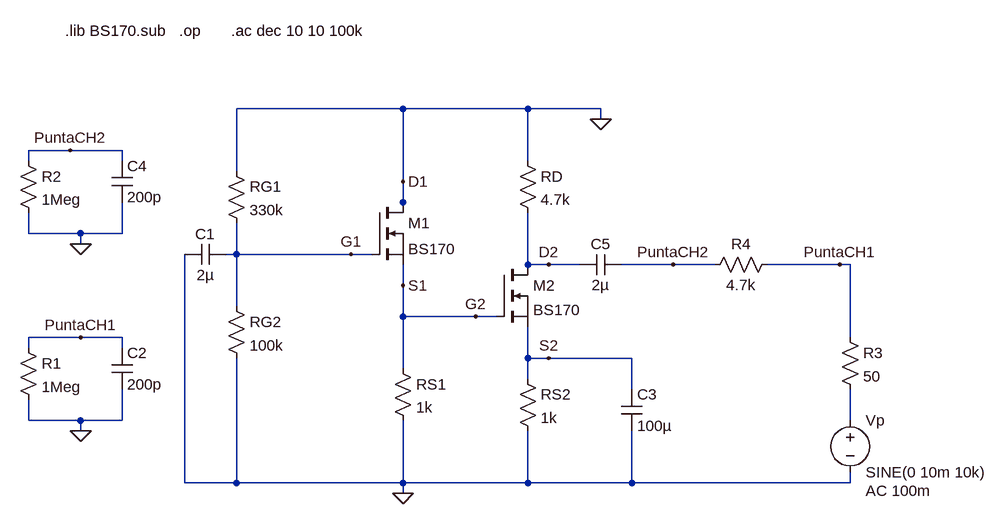
[diagram p0: schematic B_Ro.asc]
B_Ro.asc, the LTspice schematic file:
Version 4
SHEET 1 2572 856
WIRE 1008 112 752 112
WIRE 1200 112 1008 112
WIRE 1312 112 1200 112
WIRE 1312 128 1312 112
WIRE 496 176 432 176
WIRE 576 176 496 176
WIRE 432 192 432 176
WIRE 576 192 576 176
WIRE 1200 192 1200 112
WIRE 752 208 752 112
WIRE 1008 224 1008 112
WIRE 1008 256 1008 224
WIRE 1008 272 1008 256
WIRE 432 304 432 272
WIRE 512 304 432 304
WIRE 576 304 576 256
WIRE 576 304 512 304
WIRE 512 320 512 304
WIRE 752 336 752 288
WIRE 752 336 736 336
WIRE 928 336 752 336
WIRE 960 336 928 336
WIRE 1200 352 1200 272
WIRE 1232 352 1200 352
WIRE 1280 352 1232 352
WIRE 1424 352 1344 352
WIRE 1488 352 1424 352
WIRE 1680 352 1568 352
WIRE 1696 352 1680 352
WIRE 1008 384 1008 352
WIRE 752 416 752 336
WIRE 1008 432 1008 384
WIRE 1120 432 1008 432
WIRE 1152 432 1120 432
WIRE 512 464 432 464
WIRE 576 464 512 464
WIRE 1696 464 1696 352
WIRE 432 480 432 464
WIRE 576 480 576 464
WIRE 1200 496 1200 448
WIRE 1232 496 1200 496
WIRE 1360 496 1232 496
WIRE 1008 512 1008 432
WIRE 1200 528 1200 496
WIRE 1360 544 1360 496
WIRE 432 592 432 560
WIRE 512 592 432 592
WIRE 576 592 576 544
WIRE 576 592 512 592
WIRE 1696 592 1696 544
WIRE 512 608 512 592
WIRE 672 688 672 336
WIRE 752 688 752 496
WIRE 752 688 672 688
WIRE 1008 688 1008 592
WIRE 1008 688 752 688
WIRE 1200 688 1200 608
WIRE 1200 688 1008 688
WIRE 1360 688 1360 608
WIRE 1360 688 1200 688
WIRE 1696 688 1696 672
WIRE 1696 688 1360 688
WIRE 1008 704 1008 688
FLAG 1008 704 0
FLAG 1120 432 G2
FLAG 1232 352 D2
FLAG 1232 496 S2
FLAG 928 336 G1
FLAG 1008 224 D1
FLAG 1008 384 S1
FLAG 512 608 0
FLAG 512 320 0
FLAG 1312 128 0
FLAG 512 464 PuntaCH1
FLAG 1680 352 PuntaCH1
FLAG 496 176 PuntaCH2
FLAG 1424 352 PuntaCH2
SYMBOL cap 736 320 R90
WINDOW 0 0 32 VBottom 2
WINDOW 3 32 32 VTop 2
SYMATTR InstName C1
SYMATTR Value 2µ
SYMBOL voltage 1696 576 R0
WINDOW 39 0 0 Left 2
WINDOW 123 24 124 Left 2
SYMATTR Value2 AC 100m
SYMATTR InstName Vp
SYMATTR Value SINE(0 10m 10k)
SYMBOL nmos 960 256 R0
SYMATTR InstName M1
SYMATTR Value BS170
SYMBOL res 992 496 R0
SYMATTR InstName RS1
SYMATTR Value 1k
SYMBOL res 736 400 R0
SYMATTR InstName RG2
SYMATTR Value 100k
SYMBOL res 736 192 R0
SYMATTR InstName RG1
SYMATTR Value 330k
SYMBOL res 1184 176 R0
SYMATTR InstName RD
SYMATTR Value 4.7k
SYMBOL res 1184 512 R0
SYMATTR InstName RS2
SYMATTR Value 1k
SYMBOL cap 1344 544 R0
SYMATTR InstName C3
SYMATTR Value 100µ
SYMBOL cap 1344 336 R90
WINDOW 0 0 32 VBottom 2
WINDOW 3 32 32 VTop 2
SYMATTR InstName C5
SYMATTR Value 2µ
SYMBOL nmos 1152 352 R0
WINDOW 3 56 70 Left 2
SYMATTR Value BS170
SYMATTR InstName M2
SYMBOL res 416 464 R0
SYMATTR InstName R1
SYMATTR Value 1Meg
SYMBOL cap 560 480 R0
SYMATTR InstName C2
SYMATTR Value 200p
SYMBOL res 416 176 R0
SYMATTR InstName R2
SYMATTR Value 1Meg
SYMBOL cap 560 192 R0
SYMATTR InstName C4
SYMATTR Value 200p
SYMBOL res 1680 448 R0
SYMATTR InstName R3
SYMATTR Value 50
SYMBOL res 1584 336 R90
WINDOW 0 0 56 VBottom 2
WINDOW 3 32 56 VTop 2
SYMATTR InstName R4
SYMATTR Value 4.7k
TEXT 488 -8 Left 2 !.lib BS170.sub
TEXT 744 -8 Left 2 !.ac dec 10 10 100k
TEXT 664 -8 Left 2 !.op

The netlist it stands for:
* B_Ro.asc
C1 G1 0 2µ
Vp N001 0 SINE(0 10m 10k) AC 100m
M1 0 G1 S1 S1 BS170
RS1 S1 0 1k
RG2 G1 0 100k
RG1 0 G1 330k
RD 0 D2 4.7k
RS2 S2 0 1k
C3 S2 0 100µ
C5 PuntaCH2 D2 2µ
M2 D2 S1 S2 S2 BS170
R1 PuntaCH1 0 1Meg
C2 PuntaCH1 0 200p
R2 PuntaCH2 0 1Meg
C4 PuntaCH2 0 200p
R3 PuntaCH1 N001 50
R4 PuntaCH1 PuntaCH2 4.7k
.model NMOS NMOS
.model PMOS PMOS
.lib standard.mos
.lib BS170.sub
.ac dec 10 10 100k
.op
.backanno
.end